# Altium schematic sheet GD_AirIrDA_IrDA.SchDoc
size A4
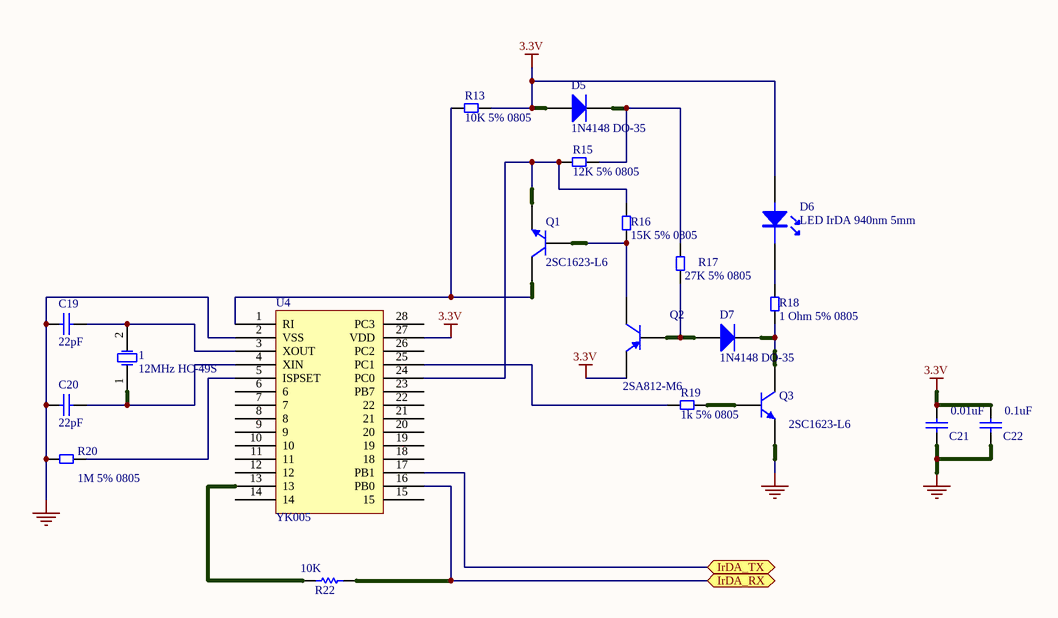
[diagram p0: GD_AirIrDA_IrDA.SchDoc]

## Parts
1  12MHz HC-49S  [XTAL_US]
C19  value 22pF  [CAPC0805(2012)75_M]  (hidden comment: CAP 22pF 5% 50V 0805)
C20  value 22pF  [CAPC0805(2012)75_M]  (hidden comment: CAP 22pF 5% 50V 0805)
C21  value 0.01uF  [CAPC0805(2012)100_N]  (hidden comment: CAP 0.01uF 20% 50V 0805)
C22  value 0.1uF  [CAPC0805(2012)100_N]  (hidden comment: CAP 0.1uF 20% 50V 0805)
D5  1N4148 DO-35  [NXP-SOD27-2_V]
D6  LED IrDA 940nm 5mm  [LED-5.0]
D7  1N4148 DO-35  [NXP-SOD27-2_V]
Q1  2SC1623-L6  [SOT-23B_N]
Q2  2SA812-M6  [SOT-23B_N]
Q3  2SC1623-L6  [SOT-23B_N]
R13  10K 5% 0805  [R0805]
R15  12K 5% 0805  [R0805]
R16  15K 5% 0805  [R0805]
R17  27K 5% 0805  [R0805]
R18  1 Ohm 5% 0805  [R0805]
R19  1k 5% 0805  [R0805]
R20  1M 5% 0805  [R0805]
R22  value 10K  [RESC0805(2012)_L]  (hidden comment: 10K 5% 0805)
U4  YK005  [IR-IC]

## Ports
IrDA_RX, IrDA_TX

## Nets
3.3V: C21.2 C22.2 D5.1(A) D6.1 Q2.3(E) R13.2 U4.27(VDD)
GND: C19.2 C20.2 C21.1 C22.1 Q3.3(E) R20.1 U4.2(VSS)
IrDA_RX: R22.2 U4.16(PB0) ; port IrDA_RX
IrDA_TX: U4.17(PB1) ; port IrDA_TX
Net1_1: 1.1(OSC1) C20.1 U4.4(XIN)
Net1_2: 1.2(OSC2) C19.1 U4.3(XOUT)
NetD5_2: D5.2(K) R15.2 R17.2
NetD6_2: D6.2 R18.2
NetD7_1: D7.1(A) Q2.2(B) R17.1
NetD7_2: D7.2(K) Q3.1(C) R18.1
NetQ1_1: Q1.1(C) R13.1 U4.1(RI)
NetQ1_2: Q1.2(B) Q2.1(C) R16.2
NetQ1_3: Q1.3(E) R15.1 R16.1 U4.24(PC0)
NetQ3_2: Q3.2(B) R19.2
NetR19_1: R19.1 U4.25(PC1)
NetR20_2: R20.2 U4.5(ISPSET)
NetR22_1: R22.1 U4.13

Not connected (* = marked no-connect by the designer): U4 6 7 8 9 10 11 12 14 15 18 19 20 21 22 23(PB7) 26(PC2) 28(PC3)

## Library data of the parts
1 = XTAL: Published: 8-Jun-2000; LatestRevisionDate: 17-Jul-2002; LatestRevisionNote: Re-released for DXP Platform.; Publisher: Altium Limited
C19 C20 = CMP-1036-01234-1: CAP 22pF 50V ±1% 0805 (2012 Metric) Thickness 0.75mm SMD; Case-EIA: 0805; Case-Metric: 2012; Rated Voltage: 50 V; Tolerance: ±1%; Technology: SMT; Max Thickness: 0.75 mm
C21 C22 = CMP-1036-00070-1: CAP 0.1uF 50V ±20% 0805 (2012 Metric) Thickness 1mm SMD; Case-Metric: 2012; Case-EIA: 0805; Tolerance: 20%; Rated Voltage: 50 V; Technology: SMT; Max Thickness: 1 mm
D5 D7 = CMP-0648-00002-1: High-speed Diode, 100 V, 450 mA, 2-Pin SOD27, RoHS; Manufacturer: NXP Semiconductors; Configuration: Single; IR (VR: 20 V)=25 nA; IFRM: 450 mA; IFSM: 4 A Max.; Trr: 4 ns Max.; Cd: 4 pF Max.; VR: 100 V Max.; VF (IF: 10 mA)=1 V; IF: 200 mA Max.; ComponentLink1Description: Manufacturer URL; RoHS: TRUE; ComponentLink1URL: http://www.nxp.com/; ComponentLink3Description: Package Specification; DatasheetVersion: Aug-04; ComponentLink2Description: Datasheet; PackageVersion: Aug-04; PackageReference: SOD27; ComponentLink3URL: http://www.nxp.com/documents/data_sheet/1N4148_1N4448.pdf; Mounting Technology: Through Hole; ComponentLink2URL: http://www.nxp.com/documents/data_sheet/1N4148_1N4448.pdf; PartNumber: 1N4148; PackageDescription: 2-Pin Hermetically Sealed Glass Package, Axial Leaded, Dia 1.85 mm, Body Length 4.25 mm, Lead Spread 25.4 mm
D6 = LED
Q1 Q3 = QNPN: NPN Bipolar Transistor; Published: 8-Jun-2000; LatestRevisionDate: 29-May-2009; LatestRevisionNote: IPC-7351 Footprint Added.; PackageVersion: Aug-1999; PackageReference: SOT-23B; Publisher: Altium Limited; PackageDescription: 3-Pin SOT-23 Package 0.95 mm Pitch, 2.4 mm Lead Span; Value: 2SC1623-L6
Q2 = PNP: PNP Bipolar Transistor; Published: 8-Jun-2000; LatestRevisionDate: 29-May-2009; LatestRevisionNote: IPC-7351 Footprint Added.; PackageVersion: Aug-1999; PackageReference: SOT-23B; Publisher: Altium Limited; PackageDescription: 3-Pin SOT-23 Package 0.95 mm Pitch, 2.4 mm Lead Span; Value: 2SA812-M6
R13 R15-R20 = RES2
R22 = CMP-1013-00098-1: 10K 0.125W 5% 0805 (2012 Metric)  SMD; Case-EIA: 0805; Case-Metric: 2012; Power: 0.125 W; Technology: SMT; Tolerance: 5 %
U4 = KT-003: 福建易控电子